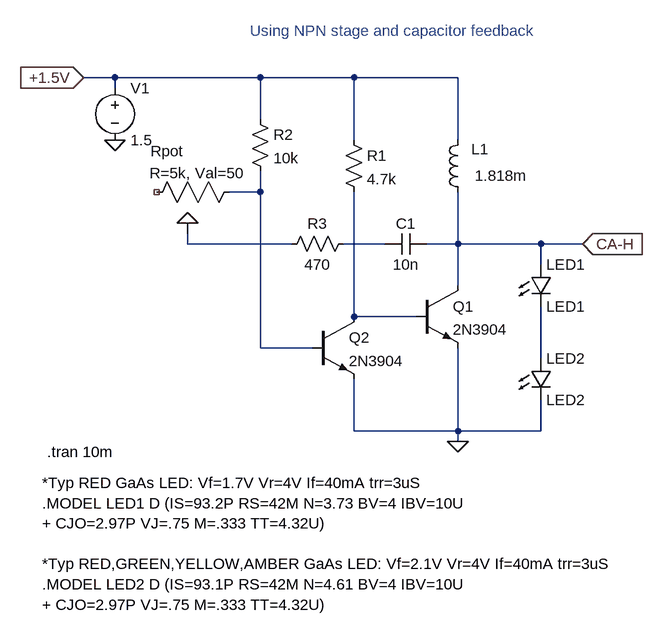
[diagram p0: schematic using_npn_stage_and_cap_feedback_ltspice.asc]
using_npn_stage_and_cap_feedback_ltspice.asc, the LTspice schematic file:
Version 4
SHEET 1 880 936
WIRE -208 128 -256 128
WIRE 16 128 -208 128
WIRE 160 128 16 128
WIRE 320 128 160 128
WIRE -208 144 -208 128
WIRE 16 192 16 128
WIRE 160 224 160 128
WIRE 320 224 320 128
WIRE 16 304 16 272
WIRE 16 304 -32 304
WIRE -96 384 -96 368
WIRE 64 384 -96 384
WIRE 208 384 144 384
WIRE 320 384 320 304
WIRE 320 384 272 384
WIRE 448 384 320 384
WIRE 512 384 448 384
WIRE 448 416 448 384
WIRE 320 448 320 384
WIRE 160 496 160 304
WIRE 256 496 160 496
WIRE 16 544 16 304
WIRE 96 544 16 544
WIRE 448 560 448 480
WIRE 160 672 160 592
WIRE 320 672 320 544
WIRE 320 672 160 672
WIRE 448 672 448 624
WIRE 448 672 320 672
WIRE 320 688 320 672
FLAG 512 384 CA-H
IOPIN 512 384 In
FLAG -256 128 +1.5V
IOPIN -256 128 In
FLAG 320 688 0
FLAG -208 224 0
SYMBOL res 144 208 R0
SYMATTR InstName R1
SYMATTR Value 4.7k
SYMBOL res 0 176 R0
SYMATTR InstName R2
SYMATTR Value 10k
SYMBOL res 160 368 R90
WINDOW 0 0 56 VBottom 2
WINDOW 3 32 56 VTop 2
SYMATTR InstName R3
SYMATTR Value 470
SYMBOL npn 256 448 R0
SYMATTR InstName Q1
SYMATTR Value 2N3904
SYMBOL npn 96 496 R0
SYMATTR InstName Q2
SYMATTR Value 2N3904
SYMBOL cap 272 368 R90
WINDOW 0 0 32 VBottom 2
WINDOW 3 32 32 VTop 2
SYMATTR InstName C1
SYMATTR Value 10n
SYMBOL ind 336 320 R180
WINDOW 0 -32 82 Left 2
WINDOW 3 -91 41 Left 2
SYMATTR InstName L1
SYMATTR Value 1.818m
SYMBOL LED 432 416 R0
SYMATTR InstName LED1
SYMATTR Value LED1
SYMBOL LED 432 560 R0
SYMATTR InstName LED2
SYMATTR Value LED2
SYMBOL potentiometer -128 320 R270
WINDOW 0 79 -25 VRight 2
WINDOW 39 45 -27 VRight 2
SYMATTR InstName Rpot
SYMATTR SpiceLine R=5k, Val=50
SYMBOL voltage -208 128 R0
SYMATTR InstName V1
SYMATTR Value 1.5
TEXT 0 56 Left 2 ;Using NPN stage and capacitor feedback
TEXT -320 752 Left 2 !*Typ RED GaAs LED: Vf=1.7V Vr=4V If=40mA trr=3uS\n.MODEL LED1 D (IS=93.2P RS=42M N=3.73 BV=4 IBV=10U\n+ CJO=2.97P VJ=.75 M=.333 TT=4.32U)\n \n*Typ RED,GREEN,YELLOW,AMBER GaAs LED: Vf=2.1V Vr=4V If=40mA trr=3uS\n.MODEL LED2 D (IS=93.1P RS=42M N=4.61 BV=4 IBV=10U\n+ CJO=2.97P VJ=.75 M=.333 TT=4.32U)
TEXT -312 704 Left 2 !.tran 10m

The netlist it stands for:
* using_npn_stage_and_cap_feedback_ltspice.asc
R1 +1.5V N004 4.7k
R2 +1.5V N001 10k
R3 N003 N002 470
Q1 CA-H N004 0 0 2N3904
Q2 N004 N001 0 0 2N3904
C1 CA-H N003 10n
L1 CA-H +1.5V 1.818m
D§LED1 CA-H N005 LED1
D§LED2 N005 0 LED2
XRpot NC_01 N002 N001 potentiometer R=5k, Val=50  ; pins 1 2 3
V1 +1.5V 0 1.5
.model D D
.lib standard.dio
.model NPN NPN
.model PNP PNP
.lib standard.bjt
* Using NPN stage and capacitor feedback
*Typ RED GaAs LED: Vf=1.7V Vr=4V If=40mA trr=3uS
.MODEL LED1 D (IS=93.2P RS=42M N=3.73 BV=4 IBV=10U
+ CJO=2.97P VJ=.75 M=.333 TT=4.32U)
*Typ RED,GREEN,YELLOW,AMBER GaAs LED: Vf=2.1V Vr=4V If=40mA trr=3uS
.MODEL LED2 D (IS=93.1P RS=42M N=4.61 BV=4 IBV=10U
+ CJO=2.97P VJ=.75 M=.333 TT=4.32U)
.tran 10m
.backanno
.end